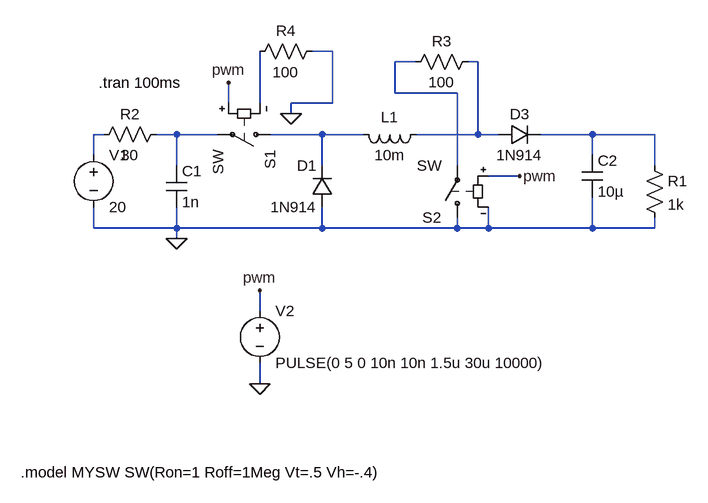
[diagram p0: schematic BuckBoost.asc]
BuckBoost.asc, the LTspice schematic file:
Version 4
SHEET 1 992 680
WIRE 432 16 400 16
WIRE 560 32 528 32
WIRE 656 32 640 32
WIRE 528 80 528 32
WIRE 624 80 528 80
WIRE 272 96 272 64
WIRE 320 96 320 16
WIRE 432 96 432 16
WIRE 432 96 368 96
WIRE 368 112 368 96
WIRE 80 144 64 144
WIRE 192 144 160 144
WIRE 256 144 192 144
WIRE 416 144 336 144
WIRE 480 144 416 144
WIRE 656 144 656 32
WIRE 656 144 560 144
WIRE 688 144 656 144
WIRE 832 144 752 144
WIRE 928 144 832 144
WIRE 64 176 64 144
WIRE 832 176 832 144
WIRE 192 192 192 144
WIRE 416 192 416 144
WIRE 624 192 624 80
WIRE 928 192 928 144
WIRE 720 208 672 208
WIRE 64 288 64 256
WIRE 192 288 192 256
WIRE 192 288 64 288
WIRE 416 288 416 256
WIRE 416 288 192 288
WIRE 624 288 624 272
WIRE 624 288 416 288
WIRE 672 288 672 256
WIRE 672 288 624 288
WIRE 832 288 832 240
WIRE 832 288 672 288
WIRE 928 288 928 272
WIRE 928 288 832 288
WIRE 192 304 192 288
WIRE 320 416 320 384
WIRE 320 528 320 496
FLAG 192 304 0
FLAG 320 528 0
FLAG 320 384 pwm
FLAG 272 64 pwm
FLAG 720 208 pwm
FLAG 368 112 0
SYMBOL Cap 176 192 R0
SYMATTR InstName C1
SYMATTR Value 1n
SYMBOL diode 432 256 R180
WINDOW 0 24 64 Left 2
WINDOW 3 24 0 Left 2
SYMATTR InstName D1
SYMATTR Value 1N914
SYMBOL ind 576 128 R90
WINDOW 0 5 56 VBottom 2
WINDOW 3 32 56 VTop 2
SYMATTR InstName L1
SYMATTR Value 10m
SYMBOL diode 688 160 R270
WINDOW 0 32 32 VTop 2
WINDOW 3 0 32 VBottom 2
SYMATTR InstName D3
SYMATTR Value 1N914
SYMBOL Cap 816 176 R0
SYMATTR InstName C2
SYMATTR Value 10µ
SYMBOL Voltage 64 160 R0
SYMATTR InstName V1
SYMATTR Value 20
SYMBOL Voltage 320 400 R0
SYMATTR InstName V2
SYMATTR Value PULSE(0 5 0 10n 10n 1.5u 30u 10000)
SYMBOL Res 912 176 R0
SYMATTR InstName R1
SYMATTR Value 1k
SYMBOL Res 176 128 R90
WINDOW 0 0 56 VBottom 2
WINDOW 3 32 56 VTop 2
SYMATTR InstName R2
SYMATTR Value 30
SYMBOL sw 352 144 R90
SYMATTR InstName S1
SYMATTR SpiceModel MYSW
SYMBOL sw 624 288 R180
SYMATTR InstName S2
SYMATTR SpiceModel MYSW
SYMBOL Res 656 16 R90
WINDOW 0 0 56 VBottom 2
WINDOW 3 32 56 VTop 2
SYMATTR InstName R3
SYMATTR Value 100
SYMBOL Res 416 0 R90
WINDOW 0 0 56 VBottom 2
WINDOW 3 32 56 VTop 2
SYMATTR InstName R4
SYMATTR Value 100
TEXT 72 64 Left 2 !.tran 100ms
TEXT -48 664 Left 2 !.model MYSW SW(Ron=1 Roff=1Meg Vt=.5 Vh=-.4)

The netlist it stands for:
* BuckBoost.asc
C1 N005 0 1n
D1 0 N006 1N914
L1 N002 N006 10m
D3 N002 N007 1N914
C2 N007 0 10µ
V1 N004 0 20
V2 pwm 0 PULSE(0 5 0 10n 10n 1.5u 30u 10000)
R1 N007 0 1k
R2 N005 N004 30
S1 N006 N005 pwm N003 MYSW SW
S2 0 N001 pwm 0 MYSW SW
R3 N002 N001 100
R4 0 N003 100
.model D D
.lib standard.dio
.tran 100ms
.model MYSW SW(Ron=1 Roff=1Meg Vt=.5 Vh=-.4)
.backanno
.end